# EAGLE schematic RH002.1 (EAGLE 7.1.0)
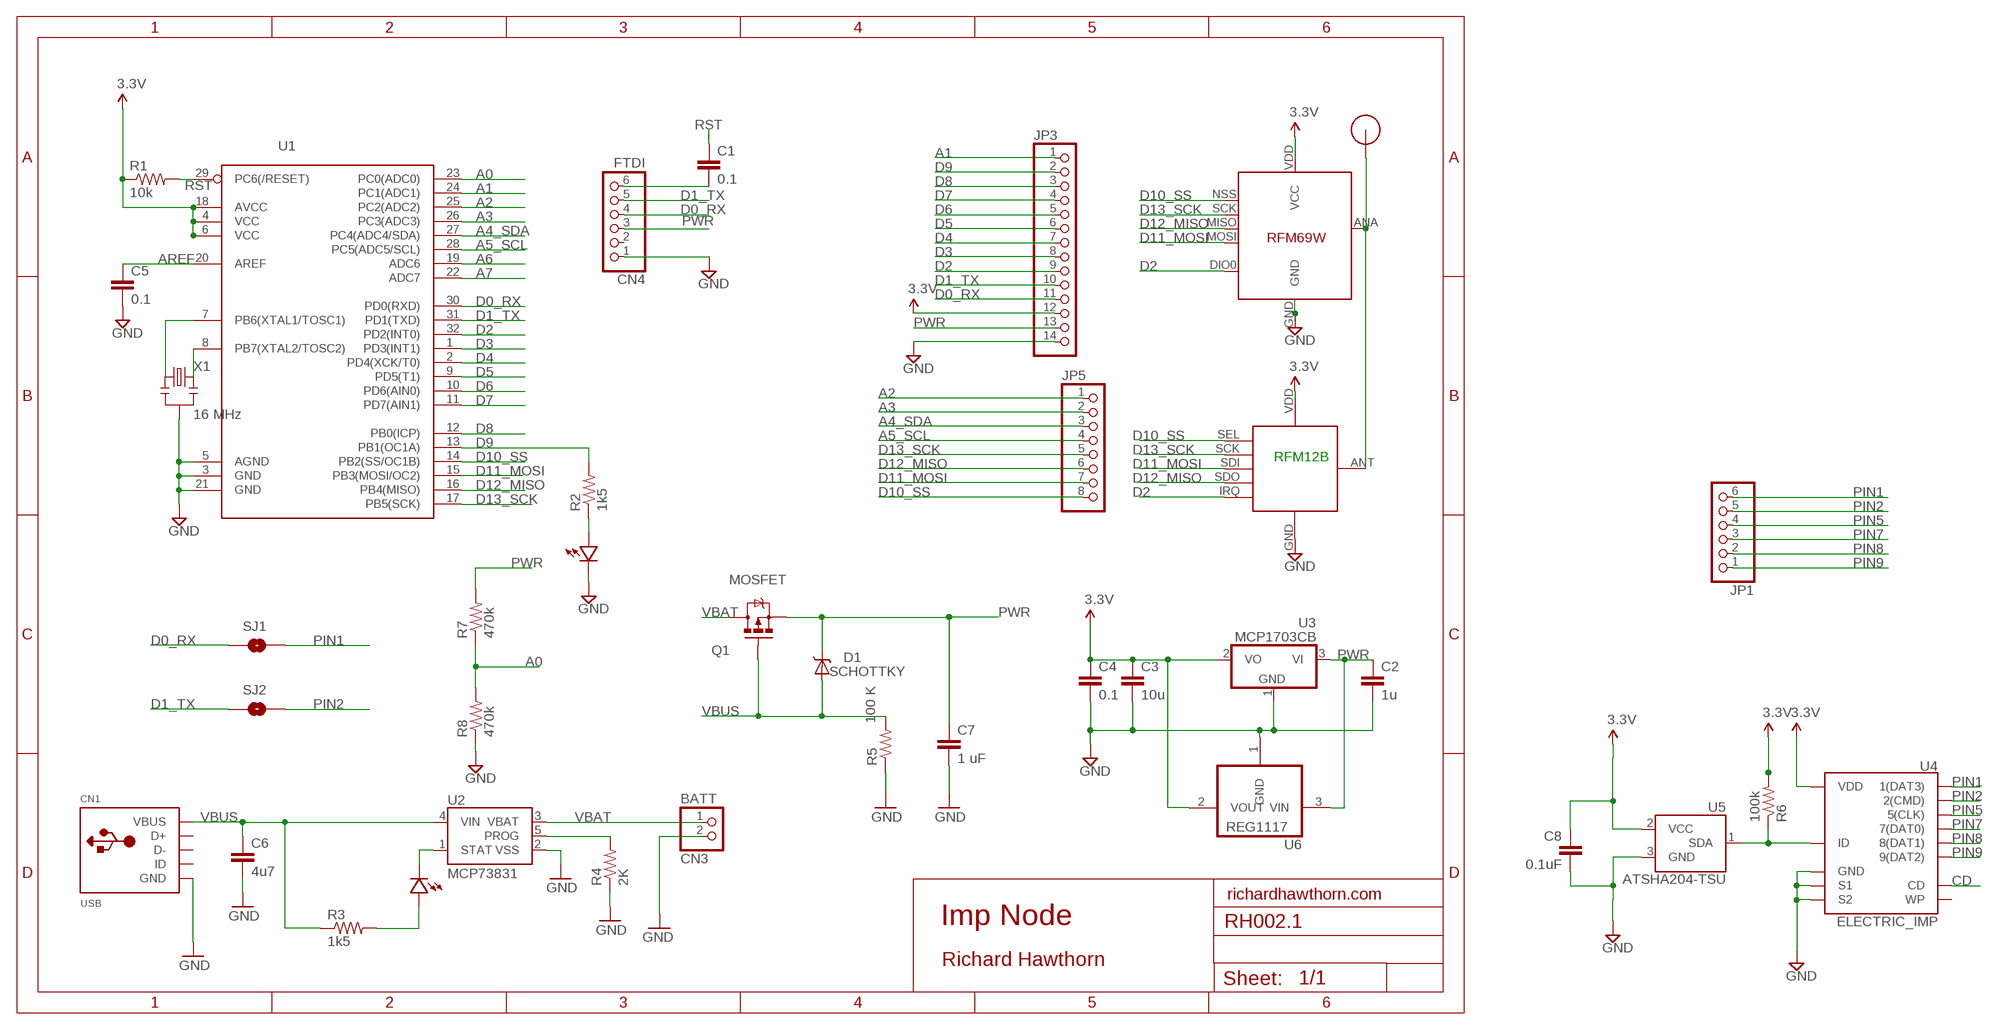
[diagram p0: schematic, sheet 1]

## Parts
C1  0.1  CAP0603-CAP  [0603-CAP]
C2  1u  CAP0603-CAP  [0603-CAP]
C3  10u  CAP0805-CAP  [0805-CAP]
C4  0.1  CAP0603-CAP  [0603-CAP]
C5  0.1  CAP0603-CAP  [0603-CAP]
C6  4u7  CAP0603-CAP  [0603-CAP]
C7  1 uF  CAP0805  [0805]
C8  0.1uF  CAP0805  [0805]
CN1  USB  USBMINIB  [USB-MINIB]
CN3  BATT  JST_2PIN-SMT-RA  [JST-PH-2-SMT-RA]
CN4  FTDI  PINHD-1X6  [1X06]
D1  SCHOTTKY  DIODE-SCHOTTKY_  [SMA-DIODE]
JP1  PINHD-1X6  [1X06]
JP3  PINHD-1X14  [1X14]
JP5  PINHD-1X8  [1X08]
LED1  LED0603  [0603-LED]
LED2  LED0603  [0603-LED]
Q1  MOSFET  MOSFET-PCHANNELSMD  [SOT23-3]
R1  10k  RESISTOR0603-RES  [0603-RES]
R2  1k5  RESISTOR0603-RES  [0603-RES]
R3  1k5  RESISTOR0603-RES  [0603-RES]
R4  2K  RESISTOR0603-RES  [0603-RES]
R5  100 K  RESISTOR0805-RES  [0805]
R6  100k  RESISTOR0805-RES  [0805]
R7  470k  RESISTOR0603-RES  [0603-RES]
R8  470k  RESISTOR0603-RES  [0603-RES]
RF1  RFM12B  RFM12B_MINPADS  [RFM12B-MINPADS]
RF2  RFM69  [RFM69W-MINPADS]
SJ1  JUMPER-PAD-2-NOYES_SILK  [PAD-JUMPER-2-NO_YES_SILK]
SJ2  JUMPER-PAD-2-NOYES_SILK  [PAD-JUMPER-2-NO_YES_SILK]
U1  ATMega-328  ATMEGA168/328TQFP32  [TQFP32-08]
U2  MCP73831  [SOT23-5]
U3  MCP1703CB  [SOT23]
U4  ELECTRIC_IMP  [SD_MMC_SOCKET]
U5  ATSHA204-TSU  [SOT23-3]
U6  REG1117  [SOT223]
U$1  RFM12B_ANTENNA  [RFM12B-ANTENNA]
X1  16 MHz  RESONATORSMD  [RESONATOR-SMD]

## Nets
A0: R7.1 R8.2 U1.23(PC0(ADC0))
A1: JP3.1 U1.24(PC1(ADC1))
A2: JP5.1 U1.25(PC2(ADC2))
A3: JP5.2 U1.26(PC3(ADC3))
A4_SDA: JP5.3 U1.27(PC4(ADC4/SDA))
A5_SCL: JP5.4 U1.28(PC5(ADC5/SCL))
A6: U1.19(ADC6)
A7: U1.22(ADC7)
AREF: C5.1 U1.20(AREF)
CD: U4.CD
D0_RX: CN4.4 JP3.11 SJ1.1 U1.30(PD0(RXD))
D1_TX: CN4.5 JP3.10 SJ2.1 U1.31(PD1(TXD))
D2: JP3.9 RF1.IRQ RF2.DIO0 U1.32(PD2(INT0))
D3: JP3.8 U1.1(PD3(INT1))
D4: JP3.7 U1.2(PD4(XCK/T0))
D5: JP3.6 U1.9(PD5(T1))
D6: JP3.5 U1.10(PD6(AIN0))
D7: JP3.4 U1.11(PD7(AIN1))
D8: JP3.3 U1.12(PB0(ICP))
D9: JP3.2 R2.2 U1.13(PB1(OC1A))
D10_SS: JP5.8 RF1.SEL RF2.NSS(SEL) U1.14(PB2(SS/OC1B))
D11_MOSI: JP5.7 RF1.SDI(SDI/MOSI) RF2.MOSI U1.15(PB3(MOSI/OC2))
D12_MISO: JP5.6 RF1.SDO(SDO/MISO) RF2.MISO U1.16(PB4(MISO))
D13_SCK: JP5.5 RF1.SCK RF2.SCK U1.17(PB5(SCK))
GND [power]: C2.2 C3.2 C4.2 C5.2 C6.2 C7.2 C8.2 CN1.GND CN3.2 CN4.1 JP3.14 LED2.MINUS R4.1 R5.1 R8.1 RF1.GND RF2.GND U1.3(GND) U1.5(AGND) U1.21(GND) U2.2(VSS) U3.1(GND) U4.3(GND) U4.S1 U4.S2 U5.3(GND) U6.1(GND) X1.2
ID: R6.1 U4.6(ID) U5.1(SDA)
N$1: U1.7(PB6(XTAL1/TOSC1)) X1.1
N$2: LED2.PLUS R2.1
N$3: RF1.ANT RF2.ANA(ANT) U$1.P$1
N$4: LED1.PLUS R3.2
N$20: C1.2 CN4.6
N$21: U1.8(PB7(XTAL2/TOSC2)) X1.3
PIN1: JP1.6 SJ1.2 U4.1(1(DAT3))
PIN2: JP1.5 SJ2.2 U4.2(2(CMD))
PIN5: JP1.4 U4.5(5(CLK))
PIN7: JP1.3 U4.7(7(DAT0))
PIN8: JP1.2 U4.8(8(DAT1))
PIN9: JP1.1 U4.9(9(DAT2))
PROG: R4.2 U2.5(PROG)
PWR [power]: C2.1 C7.1 CN4.3 D1.C JP3.13 Q1.2(S) R7.2 U3.3(VI) U6.3(VIN)
RST: C1.1 R1.2 U1.29(PC6(/RESET))
STAT: LED1.MINUS U2.1(STAT)
VBAT: CN3.1 Q1.3(D) U2.3(VBAT)
VBUS [power]: C6.1 CN1.VBUS D1.A Q1.1(G) R3.1 R5.2 U2.4(VIN)
VCC: C3.1 C4.1 C8.1 JP3.12 R1.1 R6.2 RF1.VDD RF2.VDD(VCC) U1.4(VCC) U1.6(VCC) U1.18(AVCC) U3.2(VO) U4.4(VDD) U5.2(VCC) U6.2(VOUT) ; supply symbol labelled 3.3V
Unconnected: CN1.D+ CN1.D- CN1.ID CN4.2 U4.WP

## Notes on the sheet
- RFM12B
- richardhawthorn.com
- Imp Node
- Richard Hawthorn

## Library data of the parts
C1-C5 = LowPowerLab:CAP: Capacitor Standard 0603 ceramic capacitor, and 0.1" leaded capacitor.
C6 = SparkFun:CAP: Capacitor Standard 0603 ceramic capacitor, and 0.1" leaded capacitor.
C7 = SparkFun-Capacitors:CAP: Capacitor Standard 0603 ceramic capacitor, and 0.1" leaded capacitor.
C8 = SparkFun-Passives:CAP: Capacitor Standard 0603 ceramic capacitor, and 0.1" leaded capacitor.
CN1 = LowPowerLab:USB: USB Connectors USBMINIB - Surface Mount Female Mini-B USB Connector 4UConnector: 06564 By microbuilder.eu Thru-hole RA Female Mini-B USB Connector 4UConnector: 18732 By ladyada.net
CN3 = adafruit:JST_2PIN: JST 2-Pin Connectors of various flavors SMT-RA (S2B-PH-SM4) 4UConnector #17311 SMT (B2B-PH-SM4) THM-RA (S2B-PH) THM (B2B-PH)
CN4 JP1 = pinhead:PINHD-1X6: PIN HEADER
D1 = SparkFun-DiscreteSemi:DIODE-SCHOTTKY: Commonly MBRA140.
JP3 = pinhead:PINHD-1X14: PIN HEADER
JP5 = pinhead:PINHD-1X8: PIN HEADER
LED1 LED2 = LowPowerLab:LED
Q1 = SparkFun-DiscreteSemi:MOSFET-PCHANNEL: Generic PMOSFET
R1-R4 R7 R8 = LowPowerLab:RESISTOR: Resistor Basic schematic elements and footprints for 0603, 1206, and PTH resistors.
R5 = SparkFun-Resistors:RESISTOR: Resistor Basic schematic elements and footprints for 0603, 1206, and PTH resistors.
R6 = SparkFun-Passives:RESISTOR: Resistor Basic schematic elements and footprints for 0603, 1206, and PTH resistors.
RF1 = LowPowerLab:RFM12B_MINPADS
RF2 = LowPowerLab:RFM69
SJ1 SJ2 = SparkFun-Passives:JUMPER-PAD-2-NO
U1 = LowPowerLab:ATMEGA168/328: Atmel 32-pin 8-bit micro, 16k flash.
U2 = SparkFun:MCP73831: Microchip's MCP73831 Miniature single cell, fully integrated Li-Ion, Li-polymer charge management controller http://ww1.microchip.com/downloads/en/DeviceDoc/21984a.pdf
U3 = linear:MCP1703: 250 mA, 16V, Low Quiescent Current LDO Regulator Source: http://ww1.microchip.com/downloads/en/DeviceDoc/22049b.pdf
U4 = SparkFun-RF:ELECTRIC_IMP
U5 = SparkFun-DigitalIC:ATSHA204
U6 = burr-brown:REG1117: 800mA and 1A Low Dropout (LDO) Positive Regulator 1.8V, 2.5V, 2.85V, 3.3V, 5V, and Adj; MPN: REG1117; OC_FARNELL: 1097566; OC_NEWARK: 14P6981
U$1 = LowPowerLab:RFM12B_ANTENNA
X1 = SparkFun:RESONATOR: Resonator Small SMD resonator. This is the itty bitty 10/20MHz resonators with built in caps. CSTCE10M0G55 and CSTCE20M0V53. Footprint has been reviewed closely but hasn't been tested yet.

## Net classes
1 power: width 0.381 mm, clearance 0.254 mm